# EAGLE design vcf (EAGLE 7.4.0)

## Sheet 1 of 2
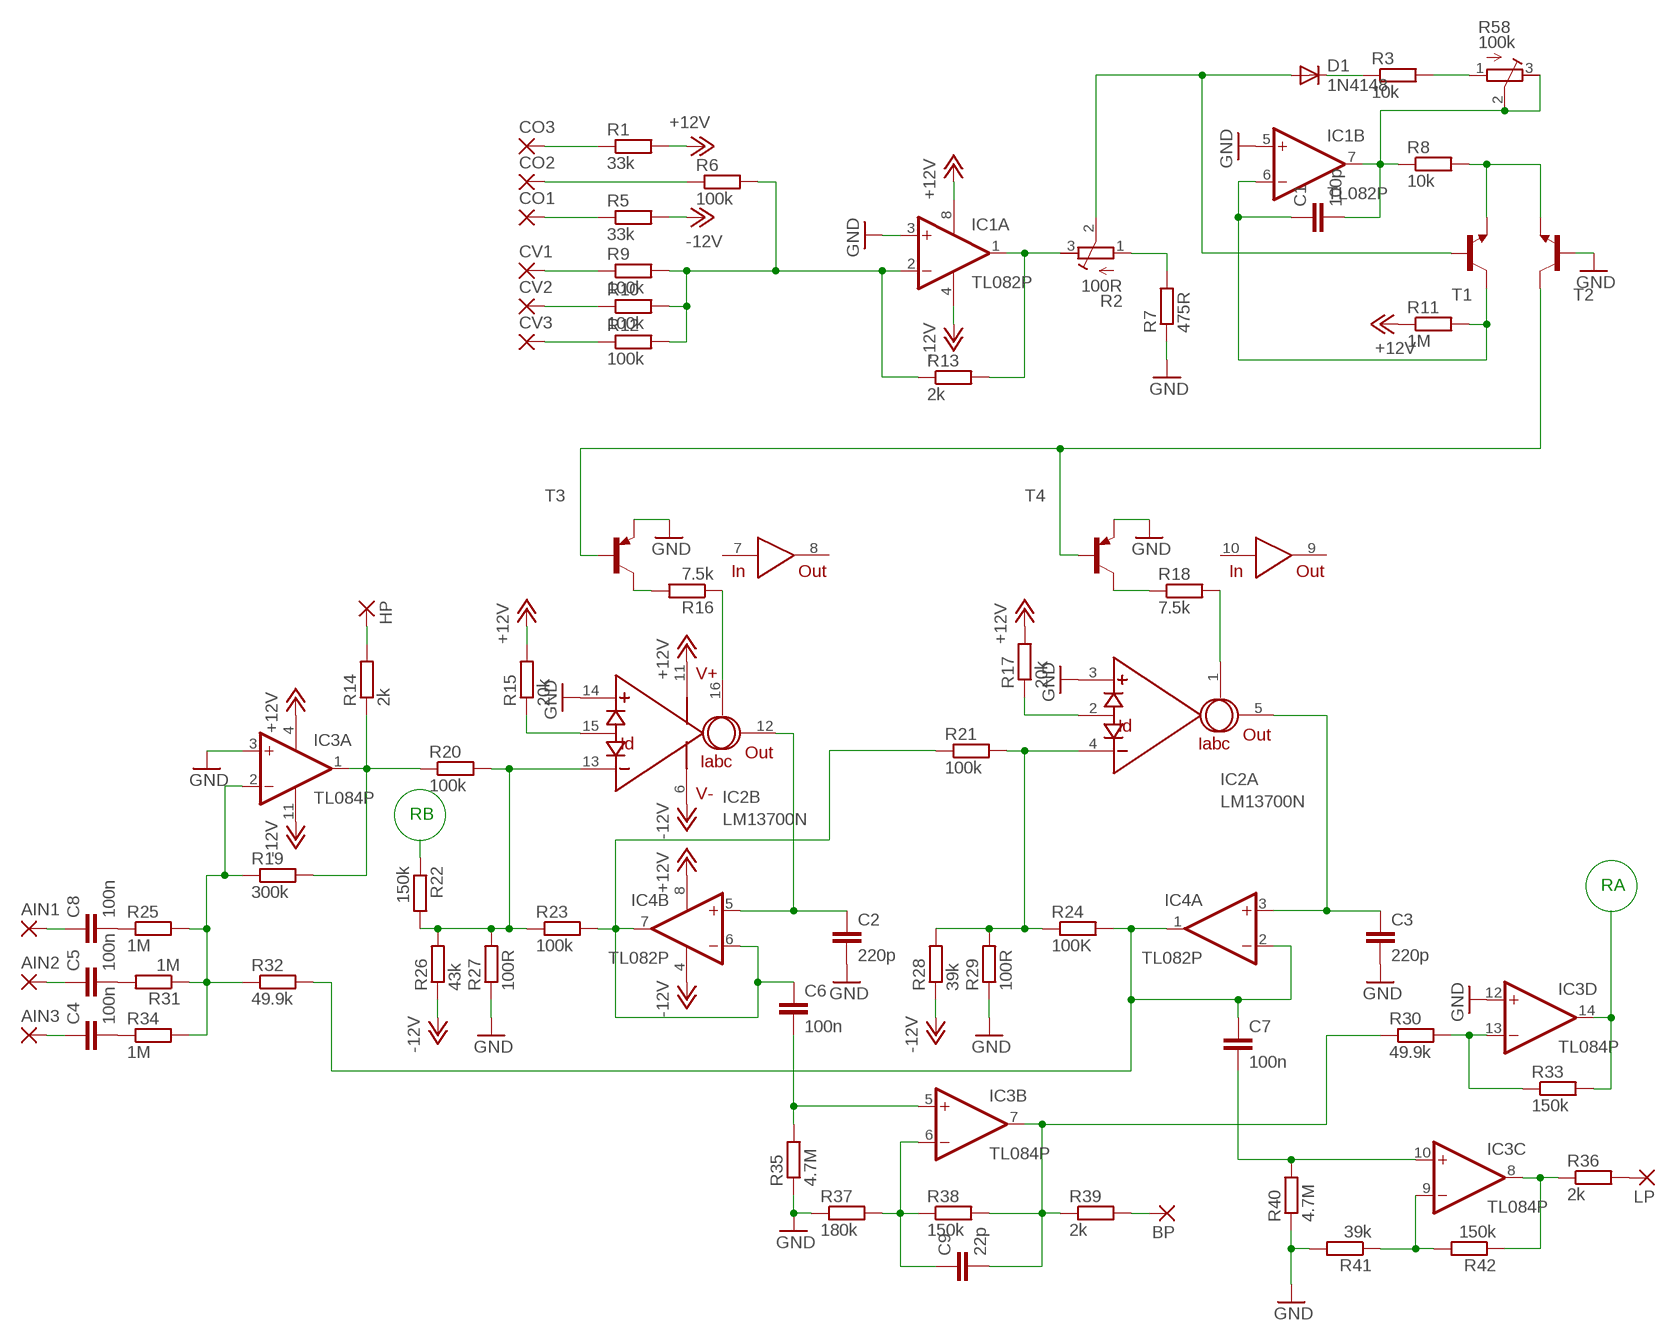
[diagram p0: schematic, sheet 1]

### Parts
AIN1  2,54/1,0  [2,54/1,0]
AIN2  2,54/1,0  [2,54/1,0]
AIN3  2,54/1,0  [2,54/1,0]
BP  2,54/1,0  [2,54/1,0]
C1  100p  C-EU050-035X075  [C050-035X075]
C2  220p  C-EU050-035X075  [C050-035X075]
C3  220p  C-EU050-035X075  [C050-035X075]
C4  100n  C-EU050-035X075  [C050-035X075]
C5  100n  C-EU050-035X075  [C050-035X075]
C6  100n  C-EU050-035X075  [C050-035X075]
C7  100n  C-EU050-035X075  [C050-035X075]
C8  100n  C-EU050-035X075  [C050-035X075]
C9  22p  C-EU050-035X075  [C050-035X075]
CO1  2,54/1,0  [2,54/1,0]
CO2  2,54/1,0  [2,54/1,0]
CO3  2,54/1,0  [2,54/1,0]
CV1  2,54/1,0  [2,54/1,0]
CV2  2,54/1,0  [2,54/1,0]
CV3  2,54/1,0  [2,54/1,0]
D1  1N4148  1N4148DO35-7  [DO35-7]
HP  2,54/1,0  [2,54/1,0]
IC1  TL082P  [DIL08]
IC2  LM13700N  [DIL16]
IC3  TL084P  [DIL14]
IC4  TL082P  [DIL08]
LP  2,54/1,0  [2,54/1,0]
R1  33k  R-EU_0309/V  [0309V]
R2  100R  R-TRIMM64W  [RTRIM64W]
R3  10k  R-EU_0309/V  [0309V]
R5  33k  R-EU_0309/V  [0309V]
R6  100k  R-EU_0309/V  [0309V]
R7  475R  R-EU_0309/V  [0309V]
R8  10k  R-EU_0309/10  [0309/10]
R9  100k  R-EU_0309/V  [0309V]
R10  100k  R-EU_0309/V  [0309V]
R11  1M  R-EU_0309/10  [0309/10]
R12  100k  R-EU_0309/V  [0309V]
R13  2k  R-EU_0309/V  [0309V]
R14  2k  R-EU_0309/V  [0309V]
R15  20k  R-EU_0309/10  [0309/10]
R16  7.5k  R-EU_0309/10  [0309/10]
R17  20k  R-EU_0309/10  [0309/10]
R18  7.5k  R-EU_0309/10  [0309/10]
R19  300k  R-EU_0309/V  [0309V]
R20  100k  R-EU_0309/V  [0309V]
R21  100k  R-EU_0309/10  [0309/10]
R22  150k  R-EU_0309/10  [0309/10]
R23  100k  R-EU_0309/10  [0309/10]
R24  100K  R-EU_0309/10  [0309/10]
R25  1M  R-EU_0309/V  [0309V]
R26  43k  R-EU_0309/V  [0309V]
R27  100R  R-EU_0309/V  [0309V]
R28  39k  R-EU_0309/10  [0309/10]
R29  100R  R-EU_0309/10  [0309/10]
R30  49.9k  R-EU_0309/V  [0309V]
R31  1M  R-EU_0309/V  [0309V]
R32  49.9k  R-EU_0309/10  [0309/10]
R33  150k  R-EU_0309/10  [0309/10]
R34  1M  R-EU_0309/V  [0309V]
R35  4.7M  R-EU_0309/V  [0309V]
R36  2k  R-EU_0309/10  [0309/10]
R37  180k  R-EU_0309/V  [0309V]
R38  150k  R-EU_0309/10  [0309/10]
R39  2k  R-EU_0309/10  [0309/10]
R40  4.7M  R-EU_0309/10  [0309/10]
R41  39k  R-EU_0309/10  [0309/10]
R42  150k  R-EU_0309/10  [0309/10]
R58  100k  R-TRIMM64W  [RTRIM64W]
T1  2N3904-NPN-TO92-EBC  [TO92-EBC]
T2  2N3904-NPN-TO92-EBC  [TO92-EBC]
T3  2N3906-PNP-TO92-EBC  [TO92-EBC]
T4  2N3906-PNP-TO92-EBC  [TO92-EBC]

### Nets
+12V: IC1.8(P:V+) IC2.11(V+) IC3.4(P:V+) IC4.8(P:V+) R1.2 R11.1 R15.2 R17.2 ; also sheet 2
-12V: IC1.4(P:V-) IC2.6(V-) IC3.11(P:V-) IC4.4(P:V-) R5.2 R26.1 R28.1 ; also sheet 2
GND: C2.2 C3.2 IC1.3(A:+IN) IC1.5(B:+IN) IC2.3(A:+IN) IC2.14(B:+IN) IC3.3(A:+IN) IC3.12(D:+IN) R7.1 R27.1 R29.1 R35.1 R37.1 R40.1 R41.2 T2.B T3.E T4.E ; also sheet 2
N$13: CO3.1(P) R1.1
N$14: CO2.1(P) R6.1
N$15: CO1.1(P) R5.1
N$16: CV1.1(P) R9.1
N$17: CV2.1(P) R10.1
N$18: CV3.1(P) R12.1
N$19: IC1.2(A:-IN) R6.2 R9.2 R10.2 R12.2 R13.1
N$20: IC1.1(A:OUT) R2.3(E) R13.2
N$21: R2.1(A) R7.2
N$22: C8.2 R25.1
N$23: R8.2 T1.E T2.E
N$24: C1.1 IC1.6(B:-IN) R11.2 T1.C
N$25: D1.C R3.1
N$26: R3.2 R58.1(A)
N$27: C1.2 IC1.7(B:OUT) R8.1 R58.2(S) R58.3(E)
N$28: D1.A R2.2(S) T1.B
N$29: T2.C T3.B T4.B
N$30: C6.2 IC3.5(B:+IN) R35.2
N$31: C5.2 R31.2
N$32: C4.2 R34.1
N$33: IC3.1(A:OUT) R14.1 R19.2 R20.1
N$34: HP.1(P) R14.2
N$35: IC3.2(A:-IN) R19.1 R25.2 R31.1 R32.1 R34.2
N$36: IC2.13(B:-IN) R20.2 R22.2 R23.1 R26.2 R27.2
N$37: IC2.15(B:ID) R15.1
N$38: IC2.2(A:ID) R17.1
N$39: IC2.16(B:IABC) R16.1
N$40: R16.2 T3.C
N$41: R18.1 T4.C
N$42: IC2.1(A:IABC) R18.2
N$43: IC2.4(A:-IN) R21.2 R24.1 R28.2 R29.2
N$44: C6.1 IC4.6(B:-IN) IC4.7(B:OUT) R21.1 R23.2
N$45: C2.1 IC2.12(B:OUT) IC4.5(B:+IN)
N$46: C3.1 IC2.5(A:OUT) IC4.3(A:+IN)
N$47: AIN1.1(P) C8.1
N$48: C9.1 IC3.6(B:-IN) R37.2 R38.1
N$50: C9.2 IC3.7(B:OUT) R30.1 R38.2 R39.1
N$51: BP.1(P) R39.2
N$52: IC3.13(D:-IN) R30.2 R33.1
N$53: AIN2.1(P) C5.1
N$54: C7.2 IC3.10(C:+IN) R40.2
N$55: IC3.9(C:-IN) R41.1 R42.2
N$56: IC3.8(C:OUT) R36.1 R42.1
N$57: LP.1(P) R36.2
N$58: AIN3.1(P) C4.1
N$59: C7.1 IC4.1(A:OUT) IC4.2(A:-IN) R24.2 R32.2
RA: IC3.14(D:OUT) R33.2 ; also sheet 2
RB: R22.1 ; also sheet 2
Unconnected: IC2.7(IN) IC2.8(OUT) IC2.9(OUT) IC2.10(IN)

### Notes on the sheet
- RB
- RA

## Sheet 2 of 2
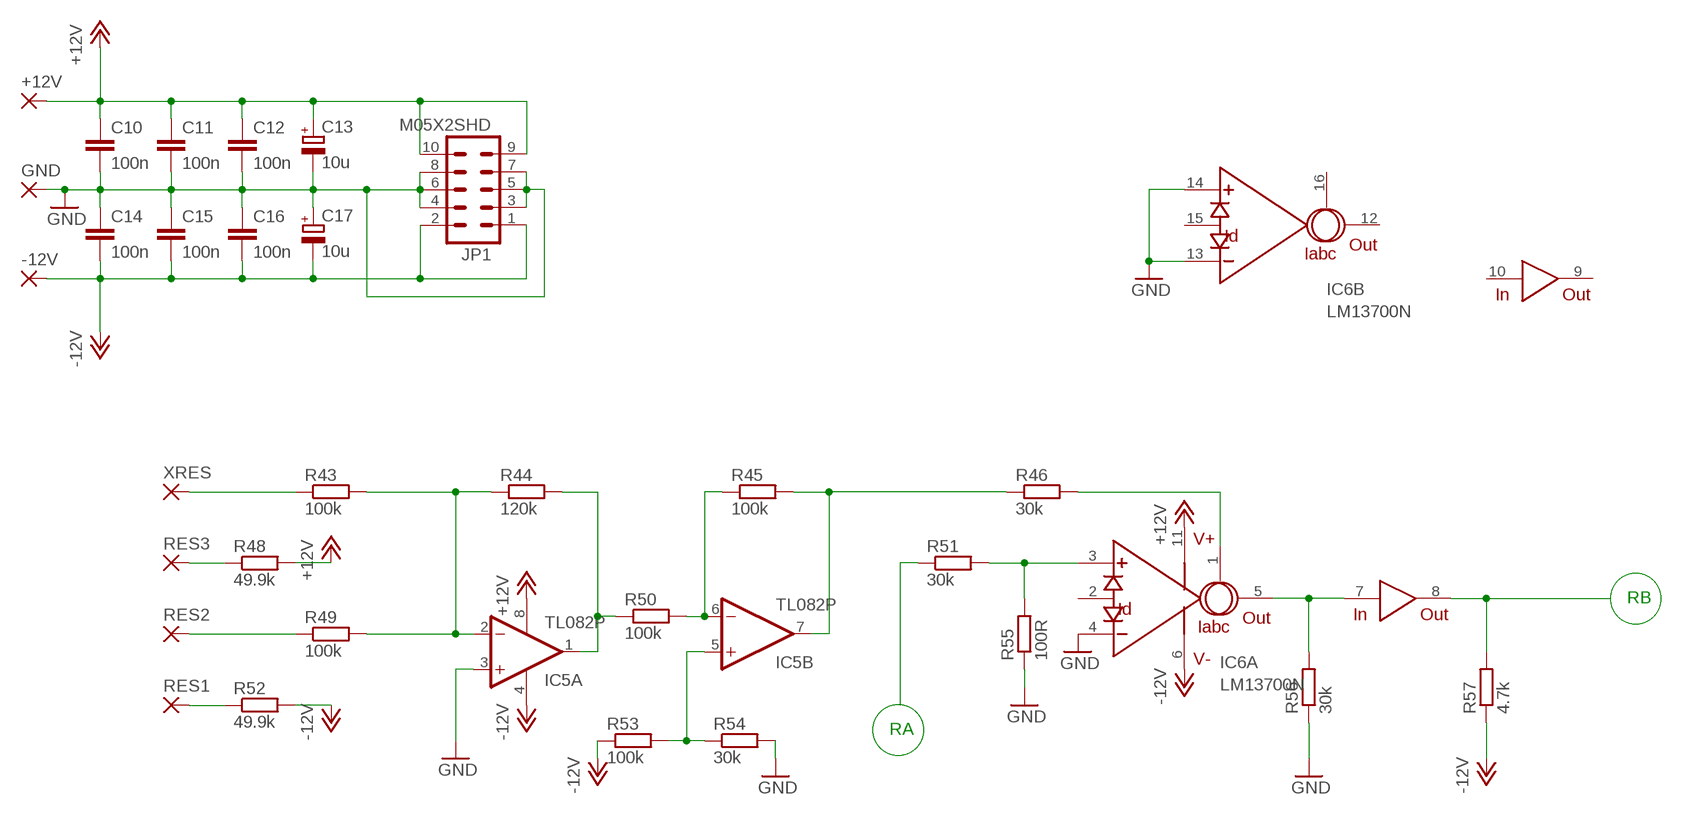
[diagram p1: schematic, sheet 2]

### Parts
+12V  2,54/1,0  [2,54/1,0]
-12V  2,54/1,0  [2,54/1,0]
C10  100n  C-EU050-035X075  [C050-035X075]
C11  100n  C-EU050-035X075  [C050-035X075]
C12  100n  C-EU050-035X075  [C050-035X075]
C13  10u  CPOL-EUE3.5-8  [E3,5-8]
C14  100n  C-EU050-035X075  [C050-035X075]
C15  100n  C-EU050-035X075  [C050-035X075]
C16  100n  C-EU050-035X075  [C050-035X075]
C17  10u  CPOL-EUE3.5-8  [E3,5-8]
GND  2,54/1,0  [2,54/1,0]
IC5  TL082P  [DIL08]
IC6  LM13700N  [DIL16]
JP1  M05X2SHD  [2X5-SHROUDED]
R43  100k  R-EU_0309/10  [0309/10]
R44  120k  R-EU_0309/10  [0309/10]
R45  100k  R-EU_0309/10  [0309/10]
R46  30k  R-EU_0309/10  [0309/10]
R48  49.9k  R-EU_0309/10  [0309/10]
R49  100k  R-EU_0309/10  [0309/10]
R50  100k  R-EU_0309/10  [0309/10]
R51  30k  R-EU_0309/10  [0309/10]
R52  49.9k  R-EU_0309/10  [0309/10]
R53  100k  R-EU_0309/10  [0309/10]
R54  30k  R-EU_0309/10  [0309/10]
R55  100R  R-EU_0309/10  [0309/10]
R56  30k  R-EU_0309/10  [0309/10]
R57  4.7k  R-EU_0309/10  [0309/10]
RES1  2,54/1,0  [2,54/1,0]
RES2  2,54/1,0  [2,54/1,0]
RES3  2,54/1,0  [2,54/1,0]
XRES  2,54/1,0  [2,54/1,0]

### Nets
+12V: +12V.1(P) C10.1 C11.1 C12.1 C13.+ IC5.8(P:V+) IC6.11(V+) JP1.9 JP1.10 R48.2 ; also sheet 1
-12V: -12V.1(P) C14.2 C15.2 C16.2 C17.- IC5.4(P:V-) IC6.6(V-) JP1.1 JP1.2 R52.2 R53.1 R57.1 ; also sheet 1
GND: C10.2 C11.2 C12.2 C13.- C14.1 C15.1 C16.1 C17.+ GND.1(P) IC5.3(A:+IN) IC6.4(A:-IN) IC6.13(B:-IN) IC6.14(B:+IN) JP1.3 JP1.4 JP1.5 JP1.6 JP1.7 JP1.8 R54.2 R55.1 R56.1 ; also sheet 1
N$1: R43.1 XRES.1(P)
N$2: R48.1 RES3.1(P)
N$3: R52.1 RES1.1(P)
N$4: R49.1 RES2.1(P)
N$5: IC5.2(A:-IN) R43.2 R44.1 R49.2
N$6: IC5.1(A:OUT) R44.2 R50.1
N$7: IC5.6(B:-IN) R45.1 R50.2
N$8: IC5.5(B:+IN) R53.2 R54.1
N$9: IC6.1(A:IABC) R46.2
N$10: IC5.7(B:OUT) R45.2 R46.1
N$11: IC6.3(A:+IN) R51.2 R55.2
N$12: IC6.5(A:OUT) IC6.7(IN) R56.2
RA: R51.1 ; also sheet 1
RB: IC6.8(OUT) R57.2 ; also sheet 1
Unconnected: IC6.2(A:ID) IC6.9(OUT) IC6.10(IN) IC6.12(B:OUT) IC6.15(B:ID) IC6.16(B:IABC)

### Notes on the sheet
- RB
- RA

## Library data of the parts
+12V -12V AIN1-AIN3 BP CO1-CO3 CV1-CV3 GND HP LP RES1-RES3 XRES = wirepad:2,54/1,0: THROUGH-HOLE PAD
C1-C12 C14-C16 = rcl:C-EU: CAPACITOR, European symbol
C13 C17 = rcl:CPOL-EU: POLARIZED CAPACITOR, European symbol
D1 = diode:1N4148: DIODE high speed (Philips)
IC1 IC4 IC5 = cavalier:TL082: OP AMP
IC2 IC6 = synthdiy:LM13700: National Dual OTA with buffers.
IC3 = cavalier:TL084: OP AMP
JP1 = SparkFun:M05X2: Header 5x2 Standard 10-pin dual row 0.1" header. Commonly used with AVR-ISP. Use with Spark Fun Electronics SKU: PRT-00778
R1 R3 R5-R46 R48-R57 = rcl:R-EU_: RESISTOR, European symbol
R2 R58 = rcl:R-TRIMM: Trimm resistor
T1 T2 = transistor-neu-to92:*-NPN-: NPN Transistror
T3 T4 = transistor-neu-to92:*-PNP-: PNP Transistror

## Board
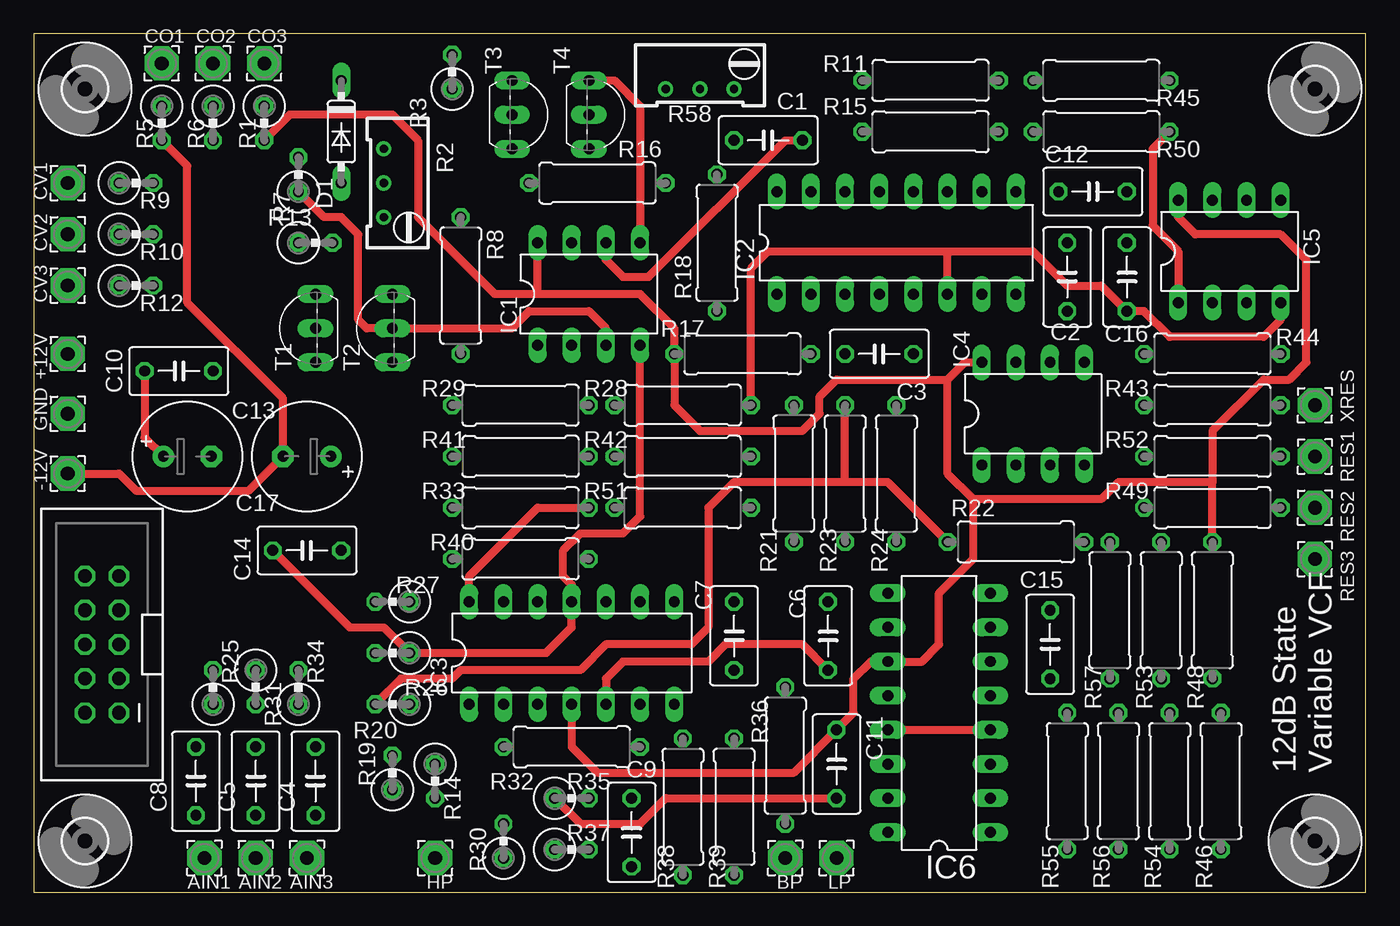
[diagram p2: board, top side]
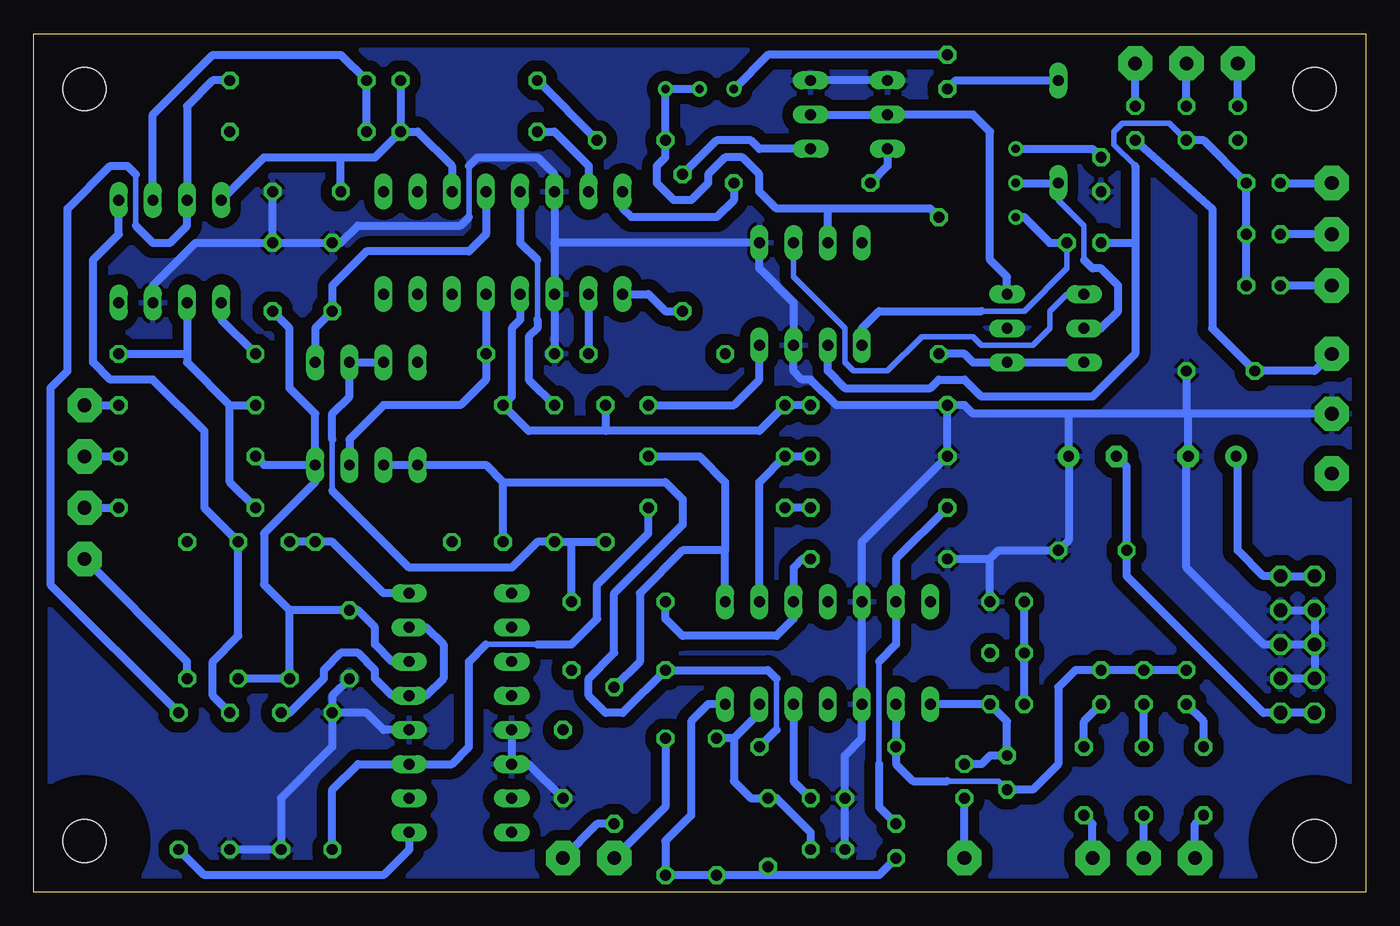
[diagram p3: board, bottom side, seen from below]

Size 99.04 x 63.8 mm. Coordinates in mm from the lower left corner, seen from the top.
Outline: 0,0 99.04,0 99.04,63.8 0,63.8 0,0
Copper layers (1*16): Top 0.035mm / dielectric 1.5mm / Bottom 0.035mm
Design rules "default": minimum track width 10mil, minimum drill 24mil, track to track 8mil, track to pad 8mil, pad to pad 8mil, via to via 8mil, smd to smd 8mil, copper to edge 40mil, drill to drill 8mil, minimum pad ring 10mil, minimum via ring 8mil, stop-mask expansion 4mil, vias tented up to drill 0mil, thermal gap 10mil

### Footprints (pad centres in the part's own frame; a part is rotated, then mirrored left to right if it is on the bottom)
2,54/1,0 = drill 1.016 pad 2.54 octagon: 1 0,0
C050-035X075 = drill 0.813 octagon: 1 -2.54,0; 2 2.54,0
E3,5-8 = drill 0.813 pad 1.6: + -1.778,0 | drill 0.813 pad 1.6 octagon: - 1.778,0
DO35-7 = drill 0.813 long: A 3.81,0; C -3.81,0
DIL08 = drill 0.813 pad 1.27 long: 1 -3.81,-3.81; 2 -1.27,-3.81; 3 1.27,-3.81; 4 3.81,-3.81; 5 3.81,3.81; 6 1.27,3.81; 7 -1.27,3.81; 8 -3.81,3.81
DIL16 = drill 0.813 long: 1 -8.89,-3.81; 2 -6.35,-3.81; 3 -3.81,-3.81; 4 -1.27,-3.81; 5 1.27,-3.81; 6 3.81,-3.81; 7 6.35,-3.81; 8 8.89,-3.81; 9 8.89,3.81; 10 6.35,3.81; 11 3.81,3.81; 12 1.27,3.81; 13 -1.27,3.81; 14 -3.81,3.81; 15 -6.35,3.81; 16 -8.89,3.81
DIL14 = drill 0.813 long: 1 -7.62,-3.81; 2 -5.08,-3.81; 3 -2.54,-3.81; 4 0,-3.81; 5 2.54,-3.81; 6 5.08,-3.81; 7 7.62,-3.81; 8 7.62,3.81; 9 5.08,3.81; 10 2.54,3.81; 11 0,3.81; 12 -2.54,3.81; 13 -5.08,3.81; 14 -7.62,3.81
2X5-SHROUDED = drill 1.016 octagon: 1 -1.27,5.08; 2 1.27,5.08; 3 -1.27,2.54; 4 1.27,2.54; 5 -1.27,0; 6 1.27,0; 7 -1.27,-2.54; 8 1.27,-2.54; 9 -1.27,-5.08; 10 1.27,-5.08
0309V = drill 0.813 octagon: 1 -1.27,0; 2 1.27,0
RTRIM64W = drill 0.61: 1 1.27,-2.54; 2 1.27,0; 3 1.27,2.54
0309/10 = drill 0.813 octagon: 1 -5.08,0; 2 5.08,0
TO92-EBC = drill 0.813 long: B 0,-1.27; C 2.54,-1.27; E -2.54,-1.27
3,2 = hole 3.2: 0,0

### Placement (x,y rotation side)
+12V  2.54,40.01 0 top
-12V  2.54,31.11 0 top
AIN1  12.7,2.54 0 top
AIN2  16.51,2.54 0 top
AIN3  20.32,2.54 0 top
BP  55.88,2.54 0 top
C1  54.61,55.88 180 top
C2  76.83,45.72 90 top
C3  62.87,40.01 180 top
C4  20.95,8.26 90 top
C5  16.51,8.26 90 top
C6  59.05,19.05 270 top
C7  52.07,19.05 90 top
C8  12.06,8.26 90 top
C9  44.45,4.45 270 top
C10  10.79,38.73 0 top
C11  59.69,9.53 270 top
C12  78.74,52.07 0 top
C13  11.43,32.38 0 top
C14  20.32,25.4 180 top
C15  75.56,18.41 90 top
C16  81.28,45.72 270 top
C17  20.32,32.38 180 top
CO1  9.53,61.59 0 top
CO2  13.34,61.59 0 top
CO3  17.14,61.59 0 top
CV1  2.54,52.7 0 top
CV2  2.54,48.9 0 top
CV3  2.54,45.09 0 top
D1  22.86,56.52 270 top
GND  2.54,35.56 0 top
HP  29.84,2.54 0 top
IC1  41.27,44.45 0 top
IC2  64.14,48.26 0 top
IC3  40.01,17.78 0 top
IC4  74.3,35.56 0 top
IC5  88.9,47.62 0 top
IC6  67.31,13.34 90 top
JP1  5.08,18.41 180 top
LP  59.69,2.54 0 top
R1  17.14,57.15 270 top
R2  27.3,52.7 180 top
R3  31.11,60.96 90 top
R5  9.53,57.15 270 top
R6  13.34,57.15 270 top
R7  19.68,53.34 90 top
R8  31.75,45.09 270 top
R9  7.62,52.7 0 top
R10  7.62,48.9 0 top
R11  66.67,60.33 180 top
R12  7.62,45.09 0 top
R13  20.95,48.26 0 top
R14  29.84,8.26 270 top
R15  66.67,56.52 0 top
R16  41.91,52.7 180 top
R17  52.7,40.01 180 top
R18  50.8,48.26 270 top
R19  26.67,8.89 90 top
R20  26.67,13.97 180 top
R21  56.52,31.11 90 top
R22  73.03,26.04 180 top
R23  60.33,31.11 270 top
R24  64.14,31.11 270 top
R25  13.34,15.24 90 top
R26  26.67,17.78 180 top
R27  26.67,21.59 180 top
R28  48.26,36.2 180 top
R29  36.2,36.2 0 top
R30  34.92,3.81 90 top
R31  16.51,15.24 270 top
R32  40.01,10.79 0 top
R33  36.2,28.57 0 top
R34  19.68,15.24 90 top
R35  40.01,6.99 0 top
R36  55.88,10.16 270 top
R37  40.01,3.17 0 top
R38  48.26,6.35 270 top
R39  52.07,6.35 90 top
R40  36.2,24.77 0 top
R41  36.2,32.38 180 top
R42  48.26,32.38 180 top
R43  87.63,36.2 180 top
R44  87.63,40.01 180 top
R45  79.38,60.33 0 top
R46  88.27,8.26 270 top
R48  87.63,20.95 90 top
R49  87.63,28.57 180 top
R50  79.38,56.52 180 top
R51  48.26,28.57 0 top
R52  87.63,32.38 180 top
R53  83.82,20.95 90 top
R54  84.45,8.26 270 top
R55  76.83,8.26 270 top
R56  80.64,8.26 90 top
R57  80.01,20.95 90 top
R58  49.53,60.96 270 top
RES1  95.25,32.38 0 top
RES2  95.25,28.57 0 top
RES3  95.25,24.77 0 top
T1  19.68,41.91 90 top
T2  25.4,41.91 90 top
T3  36.83,57.78 270 top
T4  42.55,57.78 270 top
U$1  [3,2]  3.81,3.81 0 top
U$2  [3,2]  95.25,3.81 0 top
U$3  [3,2]  95.25,59.69 0 top
U$4  [3,2]  3.81,59.69 0 top
XRES  95.25,36.2 0 top

### Tracks (layer width: path | path; a pad name or v marks a point on that pad's centre or on a via)
+12V
  Top 0.61: 69.85,29.21 67.94,31.11 67.94,38.1 | 67.94,38.1 69.22,39.37 IC4.8 | 37.47,44.45 45.09,44.45 47.62,41.91 R17.2 47.62,36.2 49.53,34.29 57.15,34.29 58.42,35.56 58.42,36.83 59.69,38.1 67.94,38.1 | 37.47,44.45 34.29,44.45 28.57,50.16 28.57,55.88 26.67,57.78 19.05,57.78 R1.2 | 37.47,44.45 IC1.8 | IC3.4 40.01,10.79 41.91,8.89 56.52,8.89 C11.1 60.96,13.34 60.96,15.88 62.23,17.14 IC6.11 66.04,17.14 67.31,18.41 67.31,22.23 69.85,24.77 69.85,29.21 | C10.1 8.26,33.78 C13.+ | 87.63,30.48 87.63,34.29 91.44,38.1 93.34,38.1 94.61,39.37 94.61,46.99 92.71,48.9 86.36,48.9 85.09,50.16 IC5.8 | 87.63,30.48 80.64,30.48 79.38,29.21 69.85,29.21 | R48.2 87.63,30.48
  Bottom 0.61: R11.1 R15.2 | R15.2 70.48,56.52 67.94,53.98 IC2.11 | JP1.10 JP1.9 7.62,23.5 9.53,25.4 9.53,32.26 C13.+ | 76.2,54.61 81.92,54.61 IC5.8 | 76.2,54.61 73.66,54.61 R15.2 | C12.1 76.2,54.61 | +12V.1 3.81,38.73 C10.1 11.43,41.91 11.43,50.8 R1.2
-12V
  Top 0.61: IC5.4 92.71,42.55 91.44,41.27 84.45,41.27 82.55,43.18 C16.2 79.38,45.09 76.83,45.09 74.3,47.62 67.94,47.62 | R28.1 53.34,46.35 54.61,47.62 67.94,47.62 | IC2.6 67.94,47.62 | -12V.1 6.35,31.11 7.62,29.84 16,29.84 C17.- 18.54,36.7 11.43,43.81 11.43,53.98 R5.2 | C14.2 23.5,19.68 26.04,19.68 R26.1 38.1,17.78 40.01,19.68 IC3.11 40.01,22.86 39.37,23.5 39.37,25.4 40.64,26.67 43.81,26.67 45.09,27.94 IC1.4
  Bottom 0.61: 80.01,20.95 C15.2 74.93,20.95 73.66,19.68 73.66,18.41 72.39,17.14 IC6.6 | R53.1 R57.1 80.01,20.95 | 80.01,20.95 81.92,22.86 81.92,26.67 78.11,30.48 IC4.4 | JP1.2 JP1.1 7.62,13.34 17.78,23.5 C14.2 17.78,31.62 C17.- | R28.1 46.99,36.2 45.09,38.1 IC1.4 | C16.2 80.01,41.91 80.01,37.47 78.11,35.56 IC4.4 | R52.2 81.92,31.75 IC4.4
GND
  Top 0.61: IC6.13 IC6.4 | IC1.3 42.55,41.91 41.27,43.18 36.83,43.18 35.56,41.91 T2.B 24.77,41.91 24.13,42.55 24.13,48.9 22.86,50.16 21.59,50.16 R7.1 | T4.E 43.18,60.33 45.09,58.42 IC1.5 | R35.1 40.64,5.08 45.09,5.08 46.99,6.99 C11.2
  Bottom 0.406: 66.67,50.16 66.67,53.98
  Bottom 0.61: T3.E T4.E | 60.33,48.26 IC2.14 60.33,53.34 61.59,54.61 66.04,54.61 66.67,53.98 | 60.33,48.26 IC2.3 C3.2 | IC6.13 IC6.14 62.23,9.53 C11.2 | R55.1 76.83,10.79 80.64,6.99 R56.1 R54.2 | R29.1 R41.2 37.47,26.04 IC3.12 IC3.3 37.47,11.43 38.73,10.16 R35.1 R37.1 | R29.1 39.37,36.2 41.27,38.1 41.91,38.1 42.55,38.73 IC1.3 42.55,43.81 45.09,46.35 IC1.5 60.33,48.26 | JP1.7 JP1.8 JP1.6 | JP1.6 JP1.4 JP1.3 | JP1.6 JP1.5 7.62,18.41 13.34,24.13 13.34,32.26 C13.- 13.21,35.43 13.34,35.56 | IC5.3 90.17,45.09 87,48.26 C16.1 | C16.1 C2.2 76.2,48.26 74.93,49.53 67.31,49.53 66.67,50.16 | IC6.4 73.03,12.06 74.3,13.34 R55.1 | C16.1 C12.2 | GND.1 13.34,35.56 | 13.34,35.56 22.23,35.56 | 22.23,35.56 29.21,35.56 29.84,36.2 R29.1 | 22.23,35.56 22.1,35.43 C17.+ 22.1,26.16 C14.1 27.3,25.4 27.94,24.77 | C10.2 13.34,35.56 | R40.1 27.94,24.77 | R27.1 27.94,24.77 | C15.1 76.83,14.61 R55.1
  pour Bottom (isolate 0.813): 0,63.5 0,-0.64 99.06,-0.64 99.06,63.5
N$1
  Bottom 0.61: XRES.1 R43.1
N$2
  Bottom 0.61: RES3.1 87.63,17.14 R48.1
N$3
  Bottom 0.61: RES1.1 R52.1
N$4
  Bottom 0.61: RES2.1 R49.1
N$5
  Bottom 0.61: R44.1 87.63,40.01 | IC5.2 87.63,40.01 | 87.63,40.01 87.63,39.37 84.45,36.2 | 84.45,36.2 R43.2 | R49.2 84.45,30.48 84.45,36.2
N$6
  Top 0.61: IC5.1 85.09,47.62 83.19,49.53 83.19,55.24 R50.1
  Bottom 0.61: R44.2 85.09,42.55 IC5.1
N$7
  Bottom 0.61: IC5.6 90.17,57.78 85.72,62.23 76.2,62.23 R45.1 R50.2
N$8
  Bottom 0.61: IC5.5 92.71,48.9 94.61,46.99 94.61,39.37 93.34,38.1 90.17,38.1 86.36,34.29 86.36,28.57 R53.2 83.82,19.05 85.72,17.14 85.72,14.61 R54.1
N$9
  Bottom 0.61: IC6.1 71.12,3.17 73.03,1.27 86.36,1.27 R46.2
N$10
  Bottom 0.406: 91.44,53.34 91.44,49.53
  Bottom 0.61: R46.1 97.79,22.86 97.79,37.47 96.52,38.73 96.52,50.8 93.34,53.98 92.08,53.98 91.44,53.34 | R45.2 85.72,60.33 87.63,58.42 IC5.7 87.63,49.53 88.9,48.26 90.17,48.26 91.44,49.53
N$11
  Bottom 0.406: 65.41,18.41 61.59,18.41
  Bottom 0.61: R55.2 76.83,7.62 74.93,9.53 IC6.3 67.94,9.53 66.67,10.79 66.67,17.14 65.41,18.41 | 61.59,18.41 59.05,18.41 57.15,20.32 57.15,22.86 53.34,26.67 R51.2
N$12
  Bottom 0.61: IC6.7 69.85,19.68 68.58,18.41 68.58,15.88 69.85,14.61 IC6.5 72.39,14.61 73.66,15.88 73.66,16.51 74.93,17.78 76.2,17.78 77.47,16.51 77.47,15.88 80.01,13.34 R56.2
N$13
  Bottom 0.61: R1.1 CO3.1
N$14
  Bottom 0.61: R6.1 CO2.1
N$15
  Bottom 0.61: R5.1 CO1.1
N$16
  Bottom 0.61: R9.1 CV1.1
N$17
  Bottom 0.61: CV2.1 R10.1
N$18
  Bottom 0.61: CV3.1 R12.1
N$19
  Bottom 0.406: 17.14,53.98 18.73,55.56 18.73,56.52 18.1,57.15 14.61,57.15 R6.2
  Bottom 0.61: R12.2 R10.2 R9.2 12.06,55.88 R6.2 | R13.1 17.14,48.26 | 17.14,48.26 17.14,40.01 20.32,36.83 28.57,36.83 29.84,38.1 31.75,38.1 32.38,37.47 38.73,37.47 40.01,38.73 IC1.2 | 17.14,53.98 17.14,48.26
N$20
  Bottom 0.406: 28.57,43.18 25.4,43.18 22.23,46.35 R13.2
  Bottom 0.61: IC1.1 37.47,41.91 36.2,43.18 28.57,43.18 | R2.3 25.4,50.16 23.5,48.26 R13.2
N$21
  Bottom 0.61: R2.1 20.32,55.24 R7.2
N$22
  Bottom 0.61: C8.2 12.06,12.7 R25.1
N$23
  Bottom 0.61: T1.E T2.E 29.21,39.37 29.84,40.01 R8.2
N$24
  Top 0.61: IC1.6 42.55,46.99 43.81,45.72 45.72,45.72 55.88,55.88 C1.1
  Bottom 0.406: T1.C 22.23,44.45 23.5,43.18 23.5,41.91 24.77,40.64 28.57,40.64 29.21,41.27 33.02,41.27 35.56,38.73 38.1,38.73 38.73,39.37 38.73,41.91 42.55,45.72 IC1.6
  Bottom 0.61: R11.2 C1.1
N$25
  Bottom 0.61: R3.1 30.48,60.33 D1.C
N$26
  Bottom 0.61: R3.2 44.45,62.23 R58.1
N$27
  Bottom 0.61: R58.2 R58.3 C1.2 52.07,54.61 52.7,53.98 52.7,52.7 51.44,51.44 50.16,51.44 48.9,52.7 48.9,53.34 47.62,54.61 46.35,54.61 45.09,53.34 45.09,52.07 43.81,50.8 40.01,50.8 | R8.1 32.38,50.8 40.01,50.8 | IC1.7 40.01,50.8
N$28
  Bottom 0.406: D1.A 22.86,51.44 20.95,49.53 20.95,46.99
  Bottom 0.61: R2.2 D1.A | T1.B 19.68,41.91 18.41,43.18 18.41,45.09 19.68,46.35 20.32,46.35 20.95,46.99
N$29
  Bottom 0.61: T4.B T3.B 29.21,57.78 27.94,56.52 27.94,46.99 26.67,45.72 T2.C
N$30
  Top 0.61: C6.2 57.15,18.41 51.44,18.41 50.16,17.14 43.81,17.14 42.55,15.88 IC3.5
  Bottom 0.61: IC3.5 42.55,8.26 R35.2
N$31
  Bottom 0.61: C5.2 R31.2
N$32
  Bottom 0.61: C4.2 20.95,12.7 R34.1
N$33
  Bottom 0.61: R14.1 28.57,9.53 27.94,10.16 R19.2 26.67,12.7 R20.1 IC3.1
N$34
  Bottom 0.61: HP.1 R14.2
N$35
  Bottom 0.406: 31.11,8.26 27.3,8.26 R19.1
  Bottom 0.61: IC3.2 R32.1 34.92,9.53 33.66,8.26 31.11,8.26 | R25.2 R31.1 R34.2 21.59,16.51 22.86,15.24 22.86,9.53 24.77,7.62 R19.1
N$36
  Top 0.61: R22.2 63.5,30.48 60.33,30.48 | 60.33,30.48 52.07,30.48 50.16,28.57 50.16,19.68 48.9,18.41 42.55,18.41 40.64,16.51 31.75,16.51 31.11,15.88 27.3,15.88 R20.2 | 60.33,30.48 R23.1
  Bottom 0.406: 61.59,46.99 61.59,42.55
  Bottom 0.61: IC2.13 62.87,48.26 61.59,46.99 | 61.59,42.55 61.59,41.91 62.23,41.27 62.23,38.1 R23.1 | R20.2 R26.2 R27.2
N$37
  Bottom 0.61: R15.1 60.33,56.52 57.78,53.98 IC2.15
N$38
  Bottom 0.61: IC2.2 R17.1
N$39
  Bottom 0.61: R16.1 46.99,51.44 48.26,50.16 54.61,50.16 55.24,50.8 IC2.16
N$40
  Bottom 0.61: T3.C 35.56,53.98 R16.2
N$41
  Bottom 0.61: T4.C 45.09,55.24 45.72,55.88 48.26,55.88 R18.1
N$42
  Bottom 0.61: IC2.1 53.34,44.45 52.07,43.18 R18.2
N$43
  Bottom 0.61: R29.2 R28.2 45.09,34.29 56.52,34.29 | 56.52,34.29 62.23,34.29 R24.1 63.5,36.83 63.5,41.91 62.87,42.55 IC2.4 | R21.2 56.52,34.29
N$44
  Bottom 0.406: 76.83,29.84 76.83,33.66
  Bottom 0.61: IC4.7 IC4.6 75.56,36.83 76.83,35.56 76.83,33.66 | 59.05,26.04 R23.2 61.59,26.04 63.5,24.13 71.12,24.13 76.83,29.84 | 59.05,26.04 R21.1 | C6.1 59.05,26.04
N$45
  Bottom 0.61: IC2.12 65.41,48.9 66.67,47.62 74.3,47.62 76.83,45.09 C2.1 78.11,41.91 IC4.5
N$46
  Bottom 0.61: IC2.5 C3.1 65.41,38.1 67.31,36.2 73.03,36.2 75.56,33.66 IC4.3
N$47
  Bottom 0.61: AIN1.1 12.7,5.08 C8.1
N$48
  Bottom 0.61: IC3.6 45.09,13.34 46.99,11.43 | 46.99,11.43 R38.1 | 46.99,11.43 46.99,8.26 45.72,6.99 C9.1 43.81,6.99 41.27,4.45 R37.2
N$50
  Bottom 0.61: IC3.7 48.9,13.97 50.16,12.7 50.16,5.71 52.07,3.81 R39.1 R38.2 44.45,1.27 | R30.1 36.2,1.27 44.45,1.27 | 44.45,1.27 C9.2
N$51
  Bottom 0.61: R39.2 52.07,6.35 BP.1
N$52
  Bottom 0.406: 36.2,17.14 36.2,9.53
  Bottom 0.61: 36.2,17.14 34.92,18.41 IC3.13 34.92,24.77 R33.1 | 36.2,9.53 36.2,6.35 R30.2
N$53
  Bottom 0.61: AIN2.1 C5.1
N$54
  Bottom 0.61: R40.2 41.91,24.77 42.55,24.13 IC3.10 42.55,20.32 43.81,19.05 50.8,19.05 52.07,20.32 C7.2
N$55
  Bottom 0.61: IC3.9 45.09,30.48 R42.2 R41.1
N$56
  Bottom 0.61: R42.1 49.53,32.38 47.62,30.48 47.62,25.4 | IC3.8 47.62,25.4 | 47.62,25.4 50.8,25.4 53.98,22.23 53.98,17.14 R36.1
N$57
  Bottom 0.61: R36.2 57.15,5.08 LP.1
N$58
  Bottom 0.61: AIN3.1 20.32,5.08 C4.1
N$59
  Bottom 0.406: 43.81,15.88 43.81,12.06
  Bottom 0.61: IC4.2 IC4.1 65.41,31.75 64.14,30.48 | R24.2 64.14,30.48 | 64.14,30.48 52.07,30.48 50.8,29.21 50.8,27.3 55.88,22.23 55.88,17.78 57.78,15.88 57.78,14.61 56.52,13.34 55.24,13.34 C7.1 44.45,16.51 43.81,15.88 | R32.2 43.81,12.06
RA
  Top 0.61: IC3.14 32.38,23.5 37.47,28.57 R33.2
  Bottom 0.61: R33.2 R51.1
RB
  Bottom 0.61: IC6.8 73.03,22.23 76.83,26.04 R22.1 R57.2

### Text on the board
tPlace: 12dB State / Variable VCF